# Altium schematic sheet Power.SchDoc
size A3; SheetNumber: 2; SheetTotal: 2
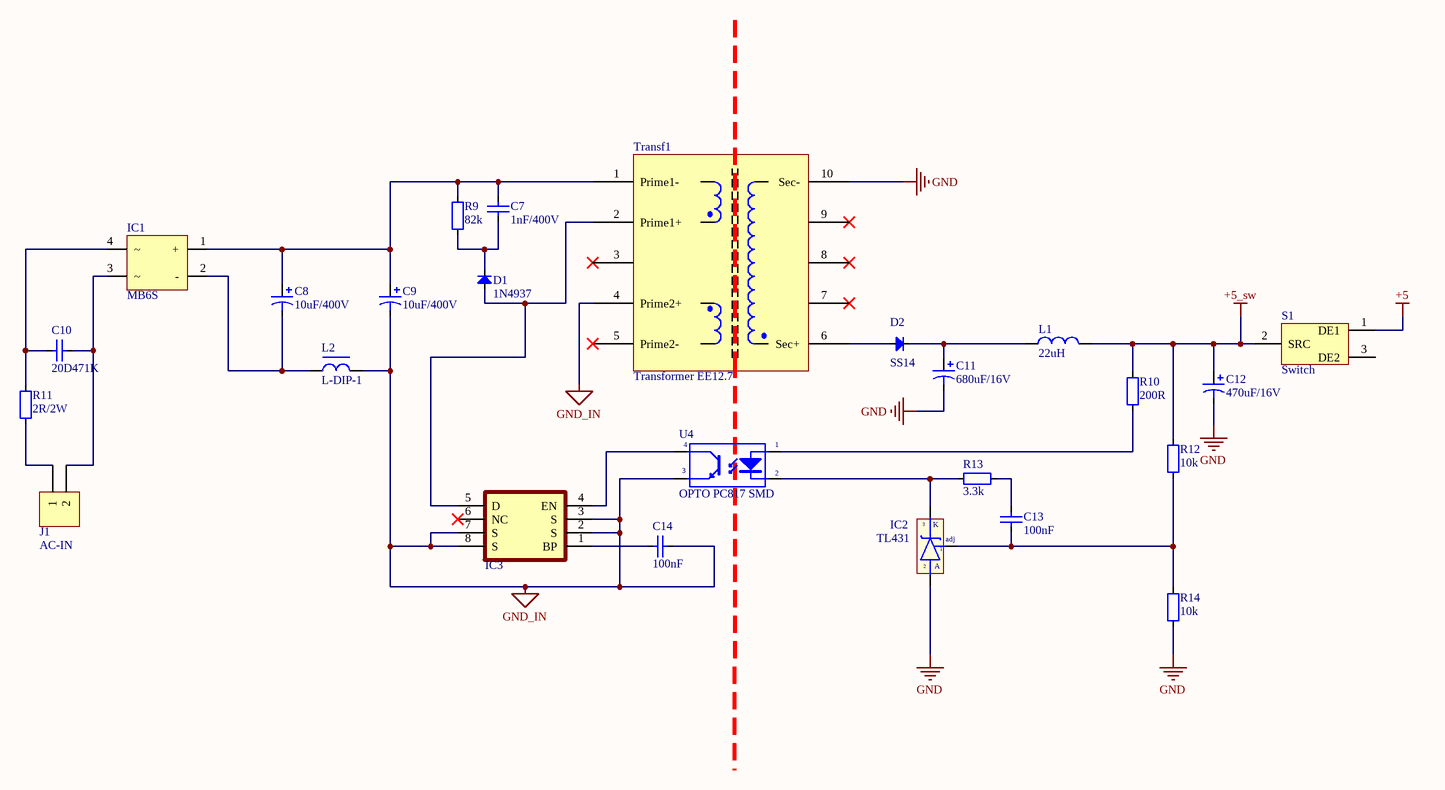
[diagram p0: Power.SchDoc]

## Parts
C7  1nF/400V  [103/2KV]
C8  10uF/400V  [C10mm]
C9  10uF/400V  [C10mm]
C10  20D471K  [103/2KV]
C11  680uF/16V  [C8mm]
C12  470uF/16V  [C8mm]
C13  100nF  [CAP_0805]
C14  100nF  [CAP_0805]
D1  1N4937  [DIO-1AN]
D2  SS14  [DO-214AC(SMA)]
IC1  MB6S  [MB6S]
IC2  TL431  [TL431_SOT]
IC3  TNY264  [DIP8]  (value not drawn)
J1  AC-IN  [KF2-5.08]
L1  22uH  [L_SMD]
L2  L-DIP-1  [Inductor]
R9  82k  [RES-SMD-2512]
R10  200R  [RES-SMD-0805]
R11  2R/2W  [RES-1WW]
R12  10k  [RES-SMD-0805]
R13  3.3k  [RES-SMD-0805]
R14  10k  [RES-SMD-0805]
S1  Switch  [Switch]
Transf1  Transformer EE12.7  [Transformer EE12.7]
U4  OPTO PC817 SMD  [SOP4]

## Nets
+5: S1.1(DE1)
+5_sw: C12.1 L1.2 R10.1 R12.1 S1.2(SRC)
GND: C11.2 C12.2 IC2.2(A) R14.2 Transf1.10(Sec-)
GND_IN: C9.2 C14.1 IC3.2(S) IC3.3(S) IC3.7(S) IC3.8(S) L2.2 Transf1.4(Prime2+) U4.3(E)
NetC7_1: C7.1 C8.1 C9.1 IC1.1(+) R9.1 Transf1.1(Prime1-)
NetC7_2: C7.2 D1.2(K) R9.2
NetC8_2: C8.2 IC1.2(-) L2.1
NetC10_1: C10.1 IC1.3 J1.2
NetC10_2: C10.2 IC1.4 R11.1
NetC11_1: C11.1 D2.2(K) L1.1
NetC13_1: C13.1 IC2.1(adj) R12.2 R14.1
NetC13_2: C13.2 R13.2
NetC14_2: C14.2 IC3.1(BP)
NetD1_1: D1.1(A) IC3.5(D) Transf1.2(Prime1+)
NetD2_1: D2.1(A) Transf1.6(Sec+)
NetIC2_3: IC2.3(K) R13.1 U4.2(K)
NetIC3_4: IC3.4(EN) U4.4(C)
NetJ1_1: J1.1 R11.2
NetR10_2: R10.2 U4.1(A)

Not connected (* = marked no-connect by the designer): IC3 6(NC)*; S1 3(DE2) 4 5; Transf1 3* 5(Prime2-)* 7* 8* 9*

## Library data of the parts
C7 = Cap2KV: CAP CERAMIC; Published: 8-Jun-2000; LatestRevisionDate: 17-Jul-2002; LatestRevisionNote: Re-released for DXP Platform.; PackageReference: RAD-0.3; Publisher: Altium Limited
C8 C9 C11 C12 = Cap Pol: Polarized Capacitor (Axial); Published: 8-Jun-2000; LatestRevisionDate: 17-Jul-2002; LatestRevisionNote: Re-released for DXP Platform.; PackageReference: POLAR0.8; Publisher: Altium Limited
C10 = Cap2KV: Varistor; Published: 8-Jun-2000; LatestRevisionDate: 17-Jul-2002; LatestRevisionNote: Re-released for DXP Platform.; PackageReference: RAD-0.3; Publisher: Altium Limited
C13 C14 = CapSMD: Capacitor; Value: 33p; Published: 8-Jun-2000; LatestRevisionDate: 17-Jul-2002; LatestRevisionNote: Re-released for DXP Platform.; PackageReference: RAD-0.3; Publisher: Altium Limited
D1 = Diode SMD: Diode Schottky / 1N4937; Code - JEDEC: DO-214-AB; Value: 1N5007; Published: 8-Jun-2000; Revision: July-2002: Re-released for DXP Platform.; Publisher: Altium Limited
D2 = Diode SMD: Diode Schottky / 1N5819; Code - JEDEC: DO-214-AB; Value: 1N5007; Published: 8-Jun-2000; Revision: July-2002: Re-released for DXP Platform.; Publisher: Altium Limited
IC2 = TL431: Programmable Shunt Regulator; Value: TL431
IC3 = TNY264: Enhanced, Energy Efficient, Low Power Off-line Switcher
J1 = KF2: Manufacturer: Würth Elektronik eiSos GmbH; partNo: 691103110002; ComponentLink1 Description: Manufacturer; ComponentLink2 Description: Datasheet; NoPins: 2; Created Date: 29 October 2013; ComponentLink1URL: http://www.we-online.com; ComponentLink2URL: http://katalog.we-online.de/em/datasheet/6911031100xx.pdf; Created by: Karrer Zheng
L1 = Inductor: CD73R 22uH 1.23A 7345; Value: 150 mH
L2 = L-DIP-1: Inductor; Value: 150 mH
R9-R14 = Resistor - SMD: Resistor; Manufacturer: Generic Components; Class: Passive; Published: 08/06/2000; Publisher: Altium Hobart Technology Centre
Transf1 = Tranformer EE16
U4 = OPTO PC817 SMD: Single Opto; Value: PC817